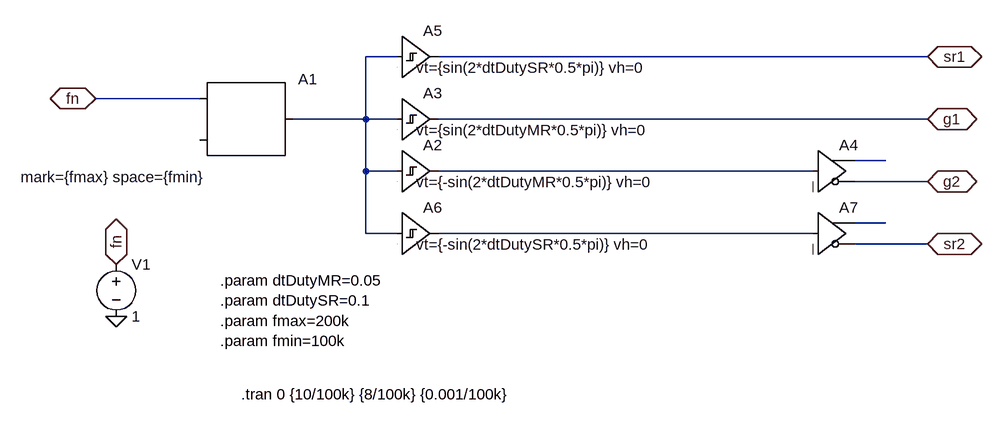
[diagram p0: schematic userLib_PFM.asc]
userLib_PFM.asc, the LTspice schematic file:
Version 4.1
SHEET 1 1648 796
WIRE 496 -176 448 -176
WIRE 1312 -176 560 -176
WIRE 192 -112 32 -112
WIRE 448 -80 448 -176
WIRE 448 -80 336 -80
WIRE 496 -80 448 -80
WIRE 1312 -80 560 -80
WIRE 1248 -16 1200 -16
WIRE 448 0 448 -80
WIRE 496 0 448 0
WIRE 1136 0 560 0
WIRE 1312 16 1200 16
WIRE 1248 80 1200 80
WIRE 448 96 448 0
WIRE 496 96 448 96
WIRE 1136 96 560 96
WIRE 1312 112 1200 112
FLAG 32 -112 fn
IOPIN 32 -112 BiDir
FLAG 1312 -80 g1
IOPIN 1312 -80 BiDir
FLAG 1312 16 g2
IOPIN 1312 16 BiDir
FLAG 1312 -176 sr1
IOPIN 1312 -176 BiDir
FLAG 1312 112 sr2
IOPIN 1312 112 BiDir
FLAG 64 224 0
FLAG 64 144 fn
IOPIN 64 144 BiDir
SYMBOL SpecialFunctions\\modulate 192 -112 R0
WINDOW 3 -275 121 Left 2
SYMATTR Value mark={fmax} space={fmin}
SYMATTR InstName A1
SYMBOL Digital\\schmtbuf 496 -144 R0
WINDOW 123 29 81 Left 2
SYMATTR Value2 vt={sin(2*dtDutyMR*0.5*pi)} vh=0
SYMATTR InstName A3
SYMBOL Digital\\schmtbuf 496 -64 R0
WINDOW 123 29 81 Left 2
SYMATTR Value2 vt={-sin(2*dtDutyMR*0.5*pi)} vh=0
SYMATTR InstName A2
SYMBOL Digital\\buf 1136 -64 R0
SYMATTR InstName A4
SYMBOL Digital\\schmtbuf 496 -240 R0
WINDOW 123 29 81 Left 2
SYMATTR Value2 vt={sin(2*dtDutySR*0.5*pi)} vh=0
SYMATTR InstName A5
SYMBOL Digital\\schmtbuf 496 32 R0
WINDOW 123 29 81 Left 2
SYMATTR Value2 vt={-sin(2*dtDutySR*0.5*pi)} vh=0
SYMATTR InstName A6
SYMBOL Digital\\buf 1136 32 R0
SYMATTR InstName A7
SYMBOL voltage 64 128 R0
SYMATTR InstName V1
SYMATTR Value 1
TEXT 224 168 Left 2 !.param dtDutyMR=0.05\n.param dtDutySR=0.1\n.param fmax=200k\n.param fmin=100k
TEXT 256 344 Left 2 !.tran 0 {10/100k} {8/100k} {0.001/100k}

The netlist it stands for:
* userLib_PFM.asc
A1 fn 0 0 0 0 0 N001 0 MODULATOR mark={fmax} space={fmin}
A3 N001 0 0 0 0 0 g1 0 SCHMITT vt={sin(2*dtDutyMR*0.5*pi)} vh=0
A2 N001 0 0 0 0 0 N003 0 SCHMITT vt={-sin(2*dtDutyMR*0.5*pi)} vh=0
A4 N003 0 0 0 0 g2 N002 0 BUF
A5 N001 0 0 0 0 0 sr1 0 SCHMITT vt={sin(2*dtDutySR*0.5*pi)} vh=0
A6 N001 0 0 0 0 0 N005 0 SCHMITT vt={-sin(2*dtDutySR*0.5*pi)} vh=0
A7 N005 0 0 0 0 sr2 N004 0 BUF
V1 fn 0 1
.param dtDutyMR=0.05
.param dtDutySR=0.1
.param fmax=200k
.param fmin=100k
.tran 0 {10/100k} {8/100k} {0.001/100k}
.backanno
.end